# EAGLE design Lights-ctrl rev00 (EAGLE 9.5.0)
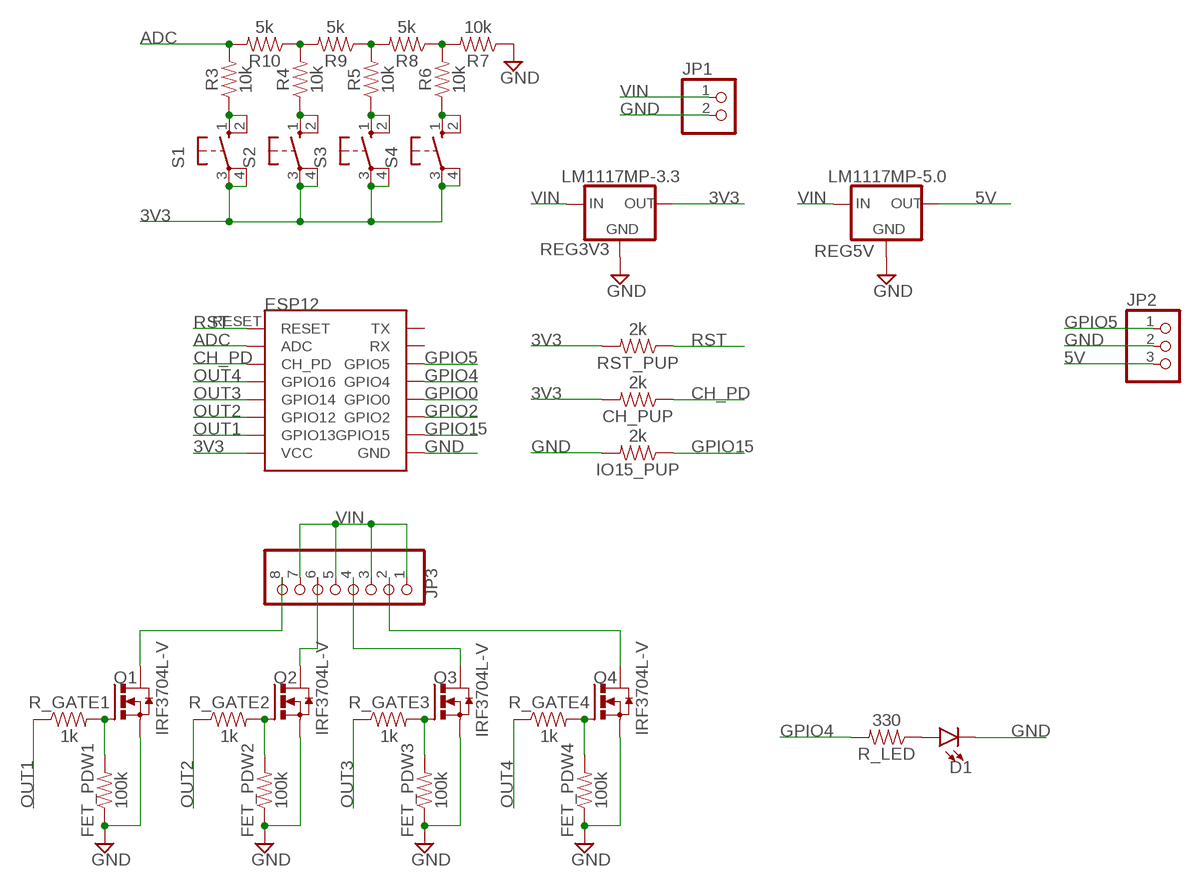
[diagram p0: schematic, sheet 1]

## Parts
CH_PUP  2k  200KOHM-0603-1/10W-1%  [0603]
D1  LED5MM-KIT  [LED_5MM-KIT]
FET_PDW1  100k  200KOHM-0603-1/10W-1%  [0603]
FET_PDW2  100k  200KOHM-0603-1/10W-1%  [0603]
FET_PDW3  100k  200KOHM-0603-1/10W-1%  [0603]
FET_PDW4  100k  200KOHM-0603-1/10W-1%  [0603]
IO15_PUP  2k  200KOHM-0603-1/10W-1%  [0603]
JP1  PINHD-1X2  [1X02]
JP2  PINHD-1X3  [1X03]
JP3  PINHD-1X8/90  [1X08/90]
Q1  IRF3704L-V  [TO262-V]
Q2  IRF3704L-V  [TO262-V]
Q3  IRF3704L-V  [TO262-V]
Q4  IRF3704L-V  [TO262-V]
R3  10k  200KOHM-0603-1/10W-1%  [0603]
R4  10k  200KOHM-0603-1/10W-1%  [0603]
R5  10k  200KOHM-0603-1/10W-1%  [0603]
R6  10k  200KOHM-0603-1/10W-1%  [0603]
R7  10k  200KOHM-0603-1/10W-1%  [0603]
R8  5k  200KOHM-0603-1/10W-1%  [0603]
R9  5k  200KOHM-0603-1/10W-1%  [0603]
R10  5k  200KOHM-0603-1/10W-1%  [0603]
R_GATE1  1k  200KOHM-0603-1/10W-1%  [0603]
R_GATE2  1k  200KOHM-0603-1/10W-1%  [0603]
R_GATE3  1k  200KOHM-0603-1/10W-1%  [0603]
R_GATE4  1k  200KOHM-0603-1/10W-1%  [0603]
R_LED  330  200KOHM-0603-1/10W-1%  [0603]
REG3V3  LM1117MP-3.3  [SOT223]
REG5V  LM1117MP-5.0  [SOT223]
RST_PUP  2k  200KOHM-0603-1/10W-1%  [0603]
S1  10-XX  [B3F-10XX]
S2  10-XX  [B3F-10XX]
S3  10-XX  [B3F-10XX]
S4  10-XX  [B3F-10XX]
U$1  ESP12E-CASTELLATED  [ESP12E-CASTELLATED]

## Nets
3V3: CH_PUP.2 REG3V3.2(OUT) REG3V3.4(OUT) RST_PUP.2 S1.3(P) S1.4(P1) S2.3(P) S2.4(P1) S3.3(P) S3.4(P1) S4.3(P) S4.4(P1) U$1.VCC
5V: JP2.3 REG5V.2(OUT) REG5V.4(OUT)
ADC: R3.2 R10.2 U$1.ADC
CH_PD: CH_PUP.1 U$1.CH_PD
GND: D1.K(C) FET_PDW1.1 FET_PDW2.1 FET_PDW3.1 FET_PDW4.1 IO15_PUP.2 JP1.2 JP2.2 Q1.3(S) Q2.3(S) Q3.3(S) Q4.3(S) R7.1 REG3V3.1(GND) REG5V.1(GND) U$1.GND
GPIO0: U$1.GPIO0
GPIO2: U$1.GPIO2
GPIO4: R_LED.2 U$1.GPIO4
GPIO5: JP2.1 U$1.GPIO5
GPIO15: IO15_PUP.1 U$1.GPIO15
N$1: FET_PDW4.2 Q4.1(G) R_GATE4.2
N$2: R6.2 R7.2 R8.1
N$3: R5.2 R8.2 R9.1
N$4: R4.2 R9.2 R10.1
N$5: D1.A R_LED.1
N$6: R3.1 S1.1(S) S1.2(S1)
N$7: R4.1 S2.1(S) S2.2(S1)
N$8: R5.1 S3.1(S) S3.2(S1)
N$9: R6.1 S4.1(S) S4.2(S1)
N$11: JP3.8 Q1.2(D)
N$12: JP3.6 Q2.2(D)
N$13: JP3.4 Q3.2(D)
N$14: JP3.2 Q4.2(D)
N$15: FET_PDW1.2 Q1.1(G) R_GATE1.2
N$18: FET_PDW2.2 Q2.1(G) R_GATE2.2
N$19: FET_PDW3.2 Q3.1(G) R_GATE3.2
OUT1: R_GATE1.1 U$1.GPIO13
OUT2: R_GATE2.1 U$1.GPIO12
OUT3: R_GATE3.1 U$1.GPIO14
OUT4: R_GATE4.1 U$1.GPIO16
RST: RST_PUP.1 U$1.RESET
VIN: JP1.1 JP3.1 JP3.3 JP3.5 JP3.7 REG3V3.3(IN) REG5V.3(IN)
Unconnected: U$1.RX U$1.TX

## Library data of the parts
CH_PUP FET_PDW1-FET_PDW4 IO15_PUP R3-R10 R_GATE1-R_GATE4 R_LED RST_PUP = SparkFun-Resistors:200KOHM: 200kΩ resistor A resistor is a passive two-terminal electrical component that implements electrical resistance as a circuit element. Resistors act to reduce current flow, and, at the same time, act to lower voltage levels within circuits. - Wikipedia; PROD_ID: RES-09385; VALUE: 200k
D1 = SparkFun-LED:LED: LED (Generic) Standard schematic elements and footprints for 5mm, 3mm, 1206, and 0603 sized LEDs. Generic LEDs with no color specified.
JP1 = pinhead:PINHD-1X2: PIN HEADER
JP2 = pinhead:PINHD-1X3: PIN HEADER
JP3 = pinhead:PINHD-1X8: PIN HEADER
Q1-Q4 = transistor-power:IRF3704: SMPS MOSFET HEXFET® Power MOSFET Source: http://www.irf.com/product-info/datasheets/data/irf3704.pdf
REG3V3 = lm1117_10:LM1117?-*: 800mA Low-Dropout Linear Regulator Source: http://www.ti.com/lit/ds/symlink/lm1117-n.pdf; MF: Texas Instruments; MPN: LM1117MP-3.3; OC_FARNELL: 9778195; OC_NEWARK: 28X3416
REG5V = lm1117_10:LM1117?-*: 800mA Low-Dropout Linear Regulator Source: http://www.ti.com/lit/ds/symlink/lm1117-n.pdf; MF: Texas Instruments; MPN: LM1117MP-5.0; OC_FARNELL: 9778209; OC_NEWARK: 28X3417
S1-S4 = switch-omron:10-XX: OMRON SWITCH; MPN: B3F-1000; OC_FARNELL: 176432; OC_NEWARK: 36M3542
U$1 = gabriel:ESP12E-CASTELLATED

## Board
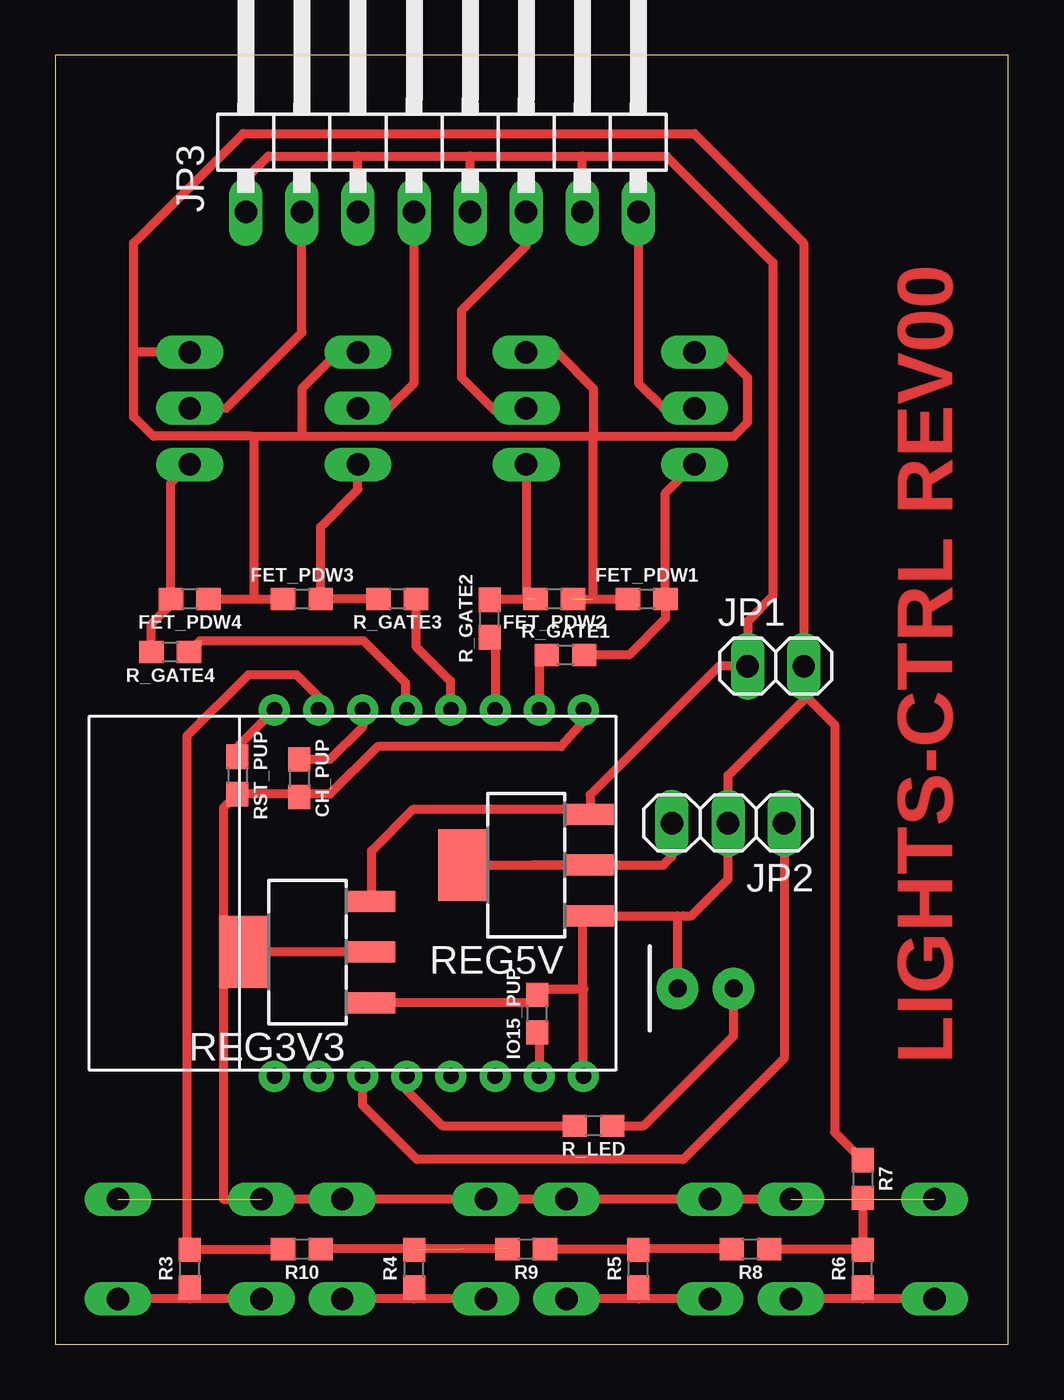
[diagram p1: board, top side]
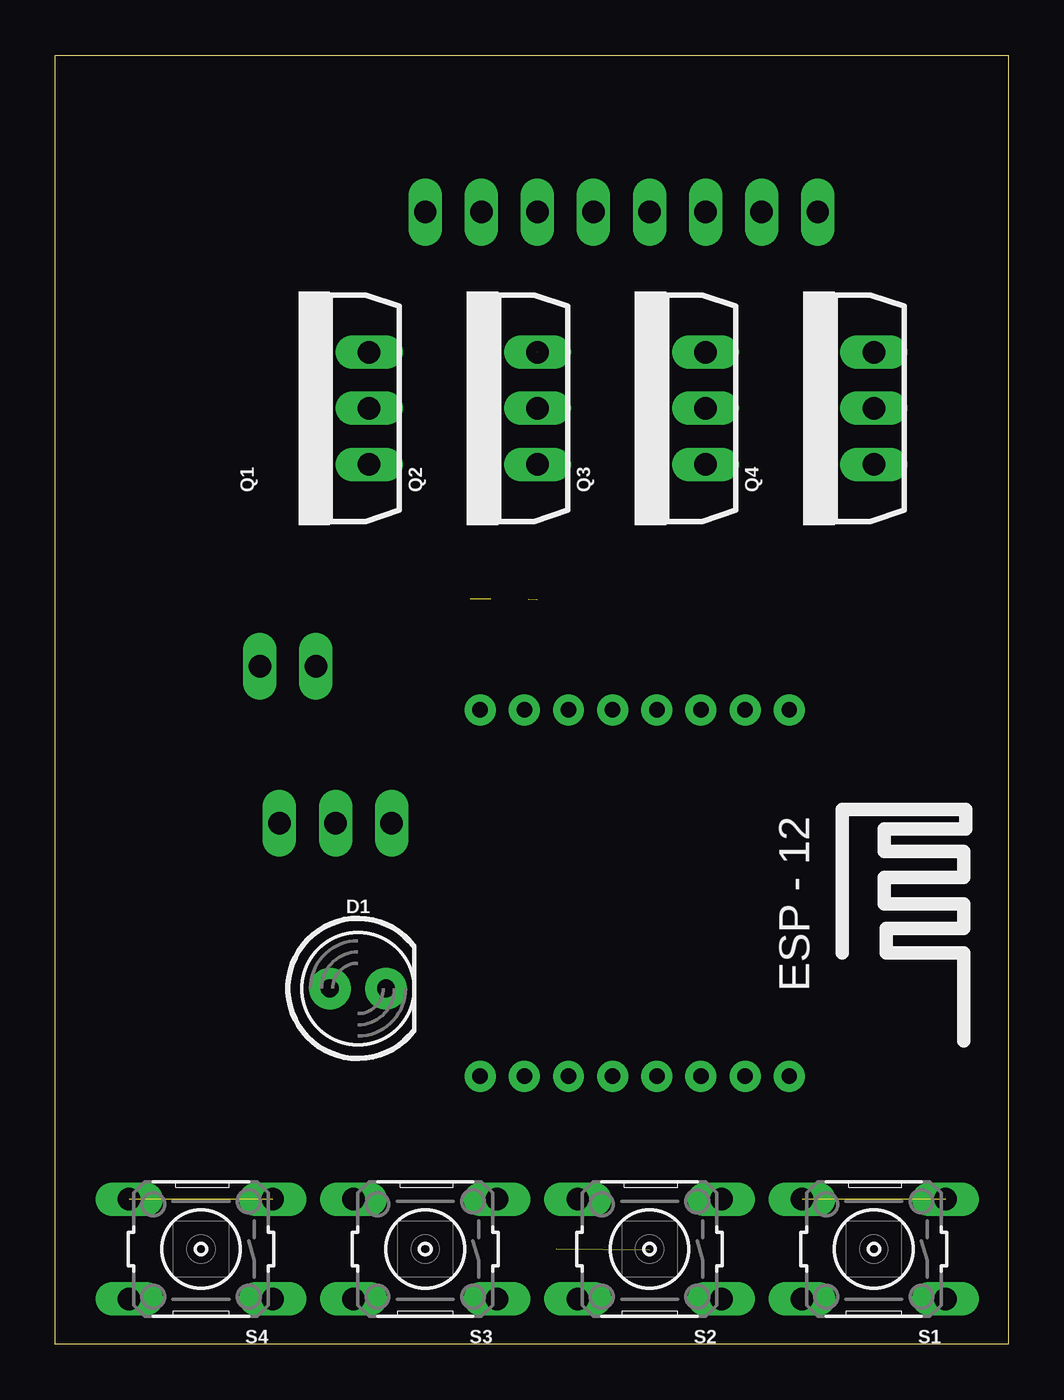
[diagram p2: board, bottom side, seen from below]

Size 43.18 x 58.42 mm. Coordinates in mm from the lower left corner, seen from the top.
Outline: 0,0 43.18,0 43.18,58.42 0,58.42 0,0
Copper layers (1*16): Top 0.035mm / dielectric 1.5mm / Bottom 0.035mm
Design rules "default": minimum track width 6mil, minimum drill 0.35mm, track to track 6mil, track to pad 6mil, pad to pad 6mil, via to via 6mil, smd to smd 6mil, copper to edge 40mil, drill to drill 6mil, minimum pad ring 10mil, minimum via ring 8mil, stop-mask expansion 4mil, vias tented up to drill 0mil, thermal gap 10mil

### Footprints (pad centres in the part's own frame; a part is rotated, then mirrored left to right if it is on the bottom)
0603 = smd 1.1 x 1: 1 -0.85,0; 2 0.85,0
LED_5MM-KIT = drill 0.813 pad 1.88: A -1.27,0; K 1.27,0
1X02 = drill 1.016 long: 1 -1.27,0; 2 1.27,0
1X03 = drill 1.016 long: 1 -2.54,0; 2 0,0; 3 2.54,0
1X08/90 = drill 1.016 long: 1 -8.89,-3.81; 2 -6.35,-3.81; 3 -3.81,-3.81; 4 -1.27,-3.81; 5 1.27,-3.81; 6 3.81,-3.81; 7 6.35,-3.81; 8 8.89,-3.81
TO262-V = drill 1.016 long: 1 -2.54,0; 2 0,0; 3 2.54,0
SOT223 = smd 0.95 x 2.15: 1 -2.3,-2.9; 2 0,-2.9; 3 2.3,-2.9 | smd 3.25 x 2.15: 4 0,2.9
B3F-10XX = drill 1.016 long: 1 -3.251,2.261; 2 3.251,2.261; 3 -3.251,-2.261; 4 3.251,-2.261
ESP12E-CASTELLATED = drill 0.7 pad 1.4: ADC -8.3,0.9; CH_PD -8.3,-1.1; GND 8.3,-11.1; GPIO0 8.3,-5.1; GPIO2 8.3,-7.1; GPIO4 8.3,-3.1; GPIO5 8.3,-1.1; GPIO12 -8.3,-7.1; GPIO13 -8.3,-9.1; GPIO14 -8.3,-5.1; GPIO15 8.3,-9.1; GPIO16 -8.3,-3.1; RESET -8.3,2.9; RX 8.3,0.9; TX 8.3,2.9; VCC -8.3,-11.1

### Placement (x,y rotation side)
CH_PUP  11.05,25.65 270 top
D1  29.46,16.13 0 bottom
FET_PDW1  26.8,33.78 0 top
FET_PDW2  22.61,33.78 180 top
FET_PDW3  11.18,33.78 0 top
FET_PDW4  6.1,33.78 180 top
IO15_PUP  21.84,14.99 90 top
JP1  32.64,30.73 0 top
JP2  30.48,23.62 180 top
JP3  17.53,55.12 0 top
Q1  28.96,42.42 90 bottom
Q2  21.34,42.42 90 bottom
Q3  13.72,42.42 90 bottom
Q4  6.1,42.42 90 bottom
R3  6.1,3.43 90 top
R4  16.26,3.43 90 top
R5  26.42,3.43 90 top
R6  36.58,3.43 90 top
R7  36.58,7.49 270 top
R8  31.5,4.32 180 top
R9  21.34,4.32 180 top
R10  11.18,4.32 180 top
R_GATE1  23.11,31.24 0 top
R_GATE2  19.68,32.89 90 top
R_GATE3  15.49,33.78 180 top
R_GATE4  5.21,31.37 180 top
R_LED  24.38,9.91 180 top
REG3V3  11.43,17.78 90 top
REG5V  21.34,21.72 90 top
RST_PUP  8.26,25.78 270 top
S1  6.1,4.32 180 bottom
S2  16.26,4.32 180 bottom
S3  26.42,4.32 180 bottom
S4  36.58,4.32 180 bottom
U$1  12.83,20.45 270 bottom

### Tracks (layer width: path | path; a pad name or v marks a point on that pad's centre or on a via)
3V3  (2 unrouted)
  Top 0.406: U$1.VCC 23.93,28.21 22.9,27.09 14.61,27.09 12.45,24.93 11.18,24.93 CH_PUP.2 10.92,24.93 RST_PUP.2 7.62,24.3 7.62,17.78 | REG3V3.2 REG3V3.4 7.62,17.78 | S4.3 S3.4 S3.3 S2.4 S2.3 S1.4 7.62,6.58 7.62,17.78
5V
  Top 0.406: REG5V.4 REG5V.2 | REG5V.2 21.59,21.72 | REG5V.2 27.55,21.72 27.94,22.11 JP2.3
ADC
  Top 0.406: U$1.ADC 11.93,29.35 10.92,30.35 8.76,30.35 5.97,27.56 5.97,4.41 R3.2 10.29,4.28 R10.2
CH_PD
  Top 0.406: U$1.CH_PD 13.93,27.98 12.45,26.5 CH_PUP.1
GND  (2 unrouted)
  Top 0.406: FET_PDW4.1 9.14,33.78 | 9.14,33.78 FET_PDW3.1 | FET_PDW2.1 FET_PDW1.1 | Q2.3 22.73,44.96 24.38,43.31 24.38,41.15 | 9.14,33.78 9.02,33.91 9.02,41.02 8.95,41.08 | 24.38,33.78 24.38,41.15 | 8.95,41.08 8.89,41.15 4.45,41.15 3.56,42.04 3.56,44.96 | 8.95,41.08 9.02,41.15 11.18,41.15 | 11.18,41.15 24.38,41.15 | Q3.3 12.83,44.96 11.18,43.31 11.18,41.15 | 24.38,41.15 30.73,41.15 31.37,41.78 31.37,43.81 30.23,44.96 Q1.3 | 3.56,44.96 3.56,49.91 8.51,54.86 28.96,54.86 33.91,49.91 JP1.2 34.04,30.61 34.04,29.34 | Q4.3 3.56,44.96 | 24.38,19.56 REG5V.1 | R7.1 35.31,9.61 35.31,28.07 34.04,29.34 | REG3V3.1 21.49,15.48 IO15_PUP.2 22.1,16.09 23.88,16.09 | 23.88,16.09 23.96,16.09 23.93,16.06 U$1.GND | REG5V.1 23.88,19.06 23.88,16.09 | REG5V.1 28.19,19.42 D1.K | 28.43,19.42 28.82,19.42 30.48,21.08 JP2.2 30.48,25.78 34.04,29.34
GPIO4
  Top 0.406: U$1.GPIO4 15.93,11.51 17.53,9.91 R_LED.2
GPIO5
  Top 0.406: U$1.GPIO5 13.93,10.84 16.38,8.38 28.45,8.38 33.02,12.95 JP2.1
GPIO15
  Top 0.406: 21.8,14.27 IO15_PUP.1 21.93,14.05 U$1.GPIO15
N$1
  Top 0.406: Q4.1 5.25,39.03 FET_PDW4.2 5.25,33.53 4.36,32.64 R_GATE4.2
N$2
  Top 0.406: R8.1 36.54,4.32 | 36.54,4.32 R6.2 | R7.2 36.58,4.36 36.54,4.32
N$3
  Top 0.406: R8.2 26.45,4.32 | 26.45,4.32 R5.2 | R9.1 26.45,4.32
N$4  (1 unrouted)
  Top 0.406: R9.2 R10.1
N$5
  Top 0.406: R_LED.1 26.67,9.91 30.73,13.97 D1.A
N$6
  Top 0.406: S1.2 6.1,2.06 | 6.1,2.06 S1.1 | R3.1 6.1,2.06
N$7
  Top 0.406: S2.2 16.26,2.06 | 16.26,2.06 S2.1 | R4.1 16.26,2.06
N$8
  Top 0.406: S3.2 26.42,2.06 | 26.42,2.06 S3.1 | R5.1 26.42,2.06
N$9
  Top 0.406: S4.2 36.58,2.06 | 36.58,2.06 S4.1 | R6.1 36.58,2.06
N$11
  Top 0.406: Q1.2 27.56,42.42 26.42,43.56 JP3.8
N$12
  Top 0.406: Q2.2 21.21,42.29 19.94,42.29 18.41,43.81 18.41,46.86 21.34,49.78 JP3.6
N$13
  Top 0.406: 14.99,42.42 Q3.2 15.11,42.42 16.26,43.56 JP3.4
N$14
  Top 0.406: Q4.2 7.75,42.42 11.18,45.85 JP3.2
N$15
  Top 0.406: Q1.1 27.65,38.57 FET_PDW1.2 27.65,32.89 26,31.24 R_GATE1.2
N$18  (1 unrouted)
  Top 0.406: FET_PDW2.2 21.72,33.74 R_GATE2.2 | Q2.1 21.34,33.74
N$19
  Top 0.406: R_GATE3.2 FET_PDW3.2 12.03,37.05 13.72,38.73 Q3.1
OUT1
  Top 0.406: U$1.GPIO13 21.93,30.91 R_GATE1.1
OUT2
  Top 0.406: R_GATE2.1 19.93,31.8 U$1.GPIO12
OUT3
  Top 0.406: R_GATE3.1 16.34,31.62 17.91,30.06 17.91,28.37 U$1.GPIO14
OUT4
  Top 0.406: U$1.GPIO16 15.88,28.4 15.88,29.97 13.97,31.88 6.57,31.88 R_GATE4.1
RST
  Top 0.406: U$1.RESET 8.26,27.07 RST_PUP.1
VIN
  Top 0.406: JP3.7 23.88,53.85 | JP3.5 18.8,53.85 | JP3.1 8.64,52.83 9.65,53.85 13.72,53.85 | 13.72,53.85 18.8,53.85 | 18.8,53.85 23.88,53.85 | JP3.3 13.72,53.85 | 23.88,53.85 27.69,53.85 32.51,49.02 32.51,33.91 31.37,32.77 JP1.1 30.08,30.73 24.24,24.9 24.24,24.91 REG5V.3 | REG3V3.3 14.33,22.37 16.22,24.26 24.24,24.26

### Text on the board
Top: LIGHTS-CTRL REV00